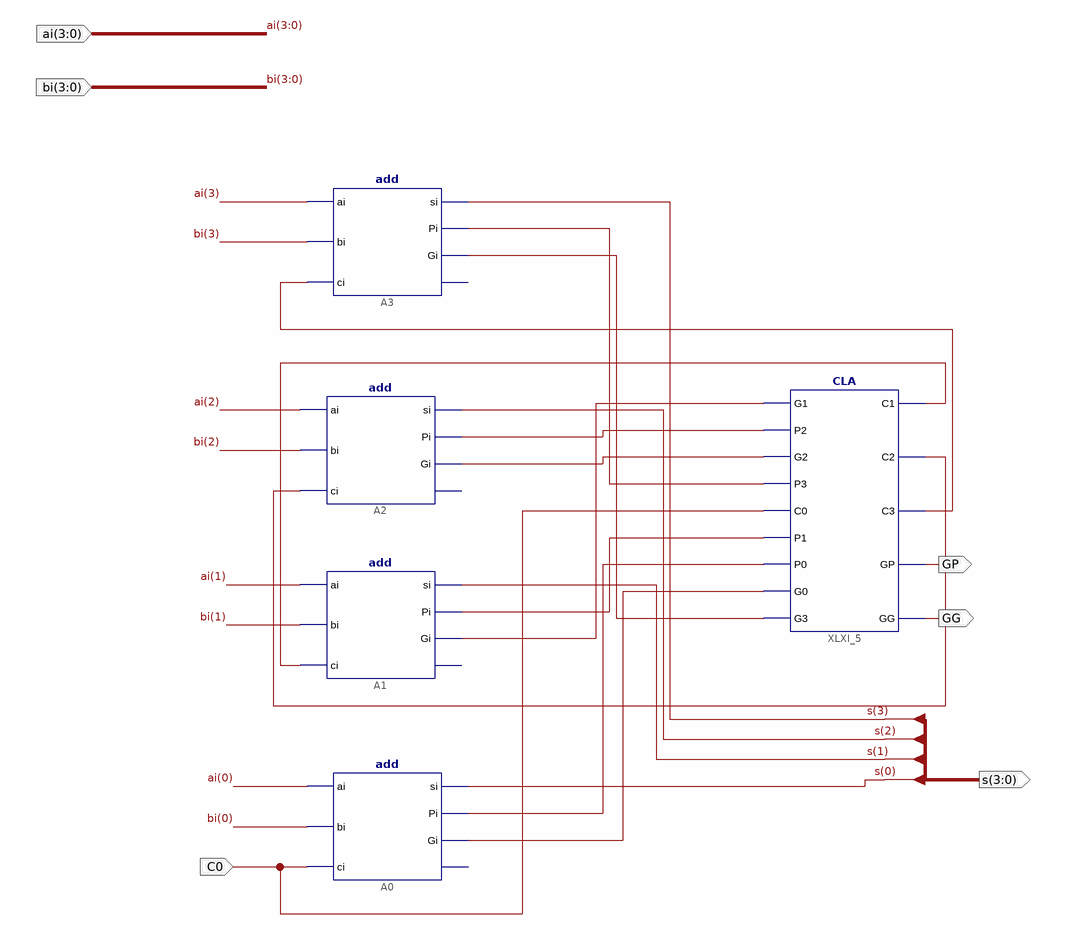
[diagram p0: schematic sheet 1]
// Xilinx ISE schematic add4b.sch (kintex7) as structural Verilog: 5 symbols, 6 ports
module add4b (
  input  [3:0] ai,
  input  [3:0] bi,
  input  C0,
  output [3:0] s,
  output GP,
  output GG
);

  wire XLXN_5, XLXN_6, XLXN_7, XLXN_20, XLXN_21, XLXN_22, XLXN_26, XLXN_27, XLXN_28, XLXN_31, XLXN_32;

  add A0 (.ai(ai[0]), .bi(bi[0]), .ci(C0), .si(s[0]), .Pi(XLXN_31), .Gi(XLXN_32));  // open: co
  add A1 (.ai(ai[1]), .bi(bi[1]), .ci(XLXN_28), .si(s[1]), .Pi(XLXN_26), .Gi(XLXN_27));  // open: co
  add A2 (.ai(ai[2]), .bi(bi[2]), .ci(XLXN_22), .si(s[2]), .Pi(XLXN_20), .Gi(XLXN_21));  // open: co
  add A3 (.ai(ai[3]), .bi(bi[3]), .ci(XLXN_5), .si(s[3]), .Pi(XLXN_7), .Gi(XLXN_6));  // open: co
  CLA XLXI_5 (
    .G1(XLXN_27), .P2(XLXN_20), .G2(XLXN_21), .P3(XLXN_7), .C0(C0), .P1(XLXN_26), .P0(XLXN_31), .G0(XLXN_32),
    .G3(XLXN_6), .C1(XLXN_28), .C2(XLXN_22), .C3(XLXN_5), .GP(GP), .GG(GG));
endmodule
